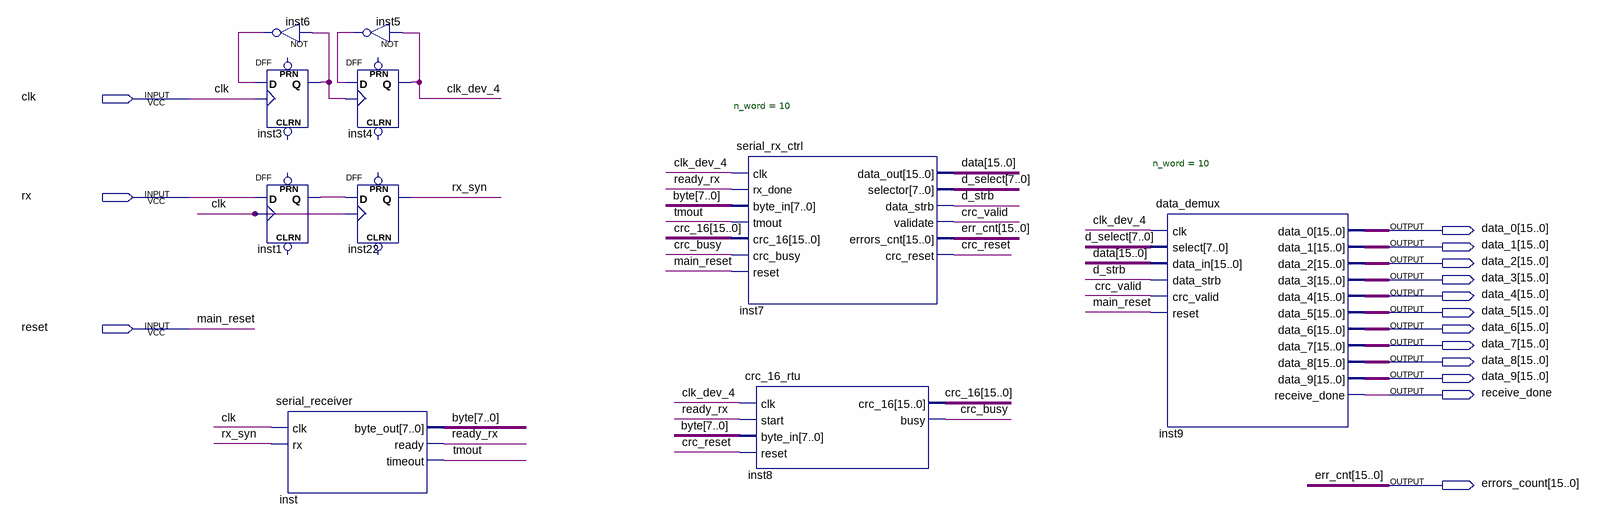
[diagram p0: schematic sheet]
// Quartus schematic serial_receiver_main_10_words.bdf as structural Verilog: 10 symbols, 15 pins
module serial_receiver_main_10_words (
  input  clk,
  input  rx,
  input  reset,
  output [15:0] data_0,
  output [15:0] data_1,
  output [15:0] data_2,
  output [15:0] data_3,
  output [15:0] data_4,
  output [15:0] data_5,
  output [15:0] data_6,
  output [15:0] data_7,
  output [15:0] data_8,
  output [15:0] data_9,
  output receive_done,
  output [15:0] errors_count
);

  wire clk_dev_4, crc_busy, crc_reset, crc_valid, d_strb, inst1_q, inst3_q, inst5_out, inst6_out, ready_rx,
       rx_syn, tmout;
  wire [7:0] \byte , d_select;
  wire [15:0] crc_16, data;

  not inst6 (inst6_out, inst3_q);
  DFF inst3 (.CLK(clk), .D(inst6_out), .Q(inst3_q));  // open: CLRN, PRN
  DFF inst1 (.CLK(clk), .D(rx), .Q(inst1_q));  // open: CLRN, PRN
  serial_receiver inst (.clk(clk), .rx(rx_syn), .byte_out(\byte ), .ready(ready_rx), .timeout(tmout));
  not inst5 (inst5_out, clk_dev_4);
  DFF inst4 (.CLK(inst3_q), .D(inst5_out), .Q(clk_dev_4));  // open: CLRN, PRN
  DFF inst22 (.CLK(clk), .D(inst1_q), .Q(rx_syn));  // open: CLRN, PRN
  serial_rx_ctrl #(.n_word(10)) inst7 (
    .clk(clk_dev_4), .rx_done(ready_rx), .byte_in(\byte ), .tmout(tmout), .crc_16(crc_16),
    .crc_busy(crc_busy), .reset(reset), .data_out(data), .selector(d_select), .data_strb(d_strb),
    .validate(crc_valid), .errors_cnt(errors_count), .crc_reset(crc_reset));
  crc_16_rtu inst8 (
    .clk(clk_dev_4), .start(ready_rx), .byte_in(\byte ), .reset(crc_reset), .crc_16(crc_16), .busy(crc_busy));
  data_demux #(.n_word(10)) inst9 (
    .clk(clk_dev_4), .select(d_select), .data_in(data), .data_strb(d_strb), .crc_valid(crc_valid),
    .reset(reset), .data_0(data_0), .data_1(data_1), .data_2(data_2), .data_3(data_3), .data_4(data_4),
    .data_5(data_5), .data_6(data_6), .data_7(data_7), .data_8(data_8), .data_9(data_9),
    .receive_done(receive_done));

  // Other names for the same wires on the sheet: err_cnt[15:0] = errors_count; main_reset = reset
endmodule
